# EAGLE design RTC-board (EAGLE 7.3.0)
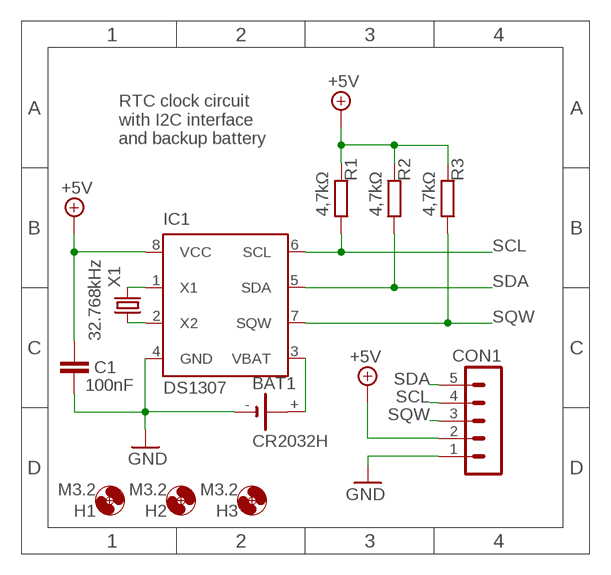
[diagram p0: schematic, sheet 1]

## Parts
BAT1  CR2032H  [CR2032H]
C1  100nF  C-EU050-025X075  [C050-025X075]
CON1  MA05-1  [MA05-1]
H1  M3.2  MOUNT-HOLE3.2  [3,2]
H2  M3.2  MOUNT-HOLE3.2  [3,2]
H3  M3.2  MOUNT-HOLE3.2  [3,2]
IC1  DS1307  [DIL08]
R1  4,7kΩ  R-EU_0207/7  [0207/7]
R2  4,7kΩ  R-EU_0207/7  [0207/7]
R3  4,7kΩ  R-EU_0207/7  [0207/7]
X1  32.768kHz  CRYSTALTC38H  [TC38H]

## Nets
+5V: C1.1 CON1.2 IC1.8(VCC) R1.2 R2.2 R3.2
GND: BAT1.- C1.2 CON1.1 IC1.4(GND)
N$20: IC1.1(X1) X1.2
N$21: IC1.2(X2) X1.1
N$22: BAT1.+ IC1.3(VBAT)
SCL: CON1.4 IC1.6(SCL) R1.1
SDA: CON1.5 IC1.5(SDA) R2.1
SQW: CON1.3 IC1.7(SQW) R3.1

## Notes on the sheet
- RTC clock circuit
  with I2C interface
  and backup battery

## Library data of the parts
BAT1 = ccr-lib:CR2032H: LI BATTERY HOLDER CR2032 horizontal
C1 = rcl:C-EU: CAPACITOR, European symbol
CON1 = con-lstb:MA05-1: PIN HEADER; OC_FARNELL: unknown; OC_NEWARK: unknown
H1-H3 = holes:MOUNT-HOLE: MOUNTING HOLE with drill center marker
IC1 = ds1307_pcf8583:DS1307: I2C-Bus CLOCK/CALENDAR
R1-R3 = rcl:R-EU_: RESISTOR, European symbol
X1 = adafruit:CRYSTAL: CRYSTAL; OC_FARNELL: unknown; OC_NEWARK: unknown

## Board
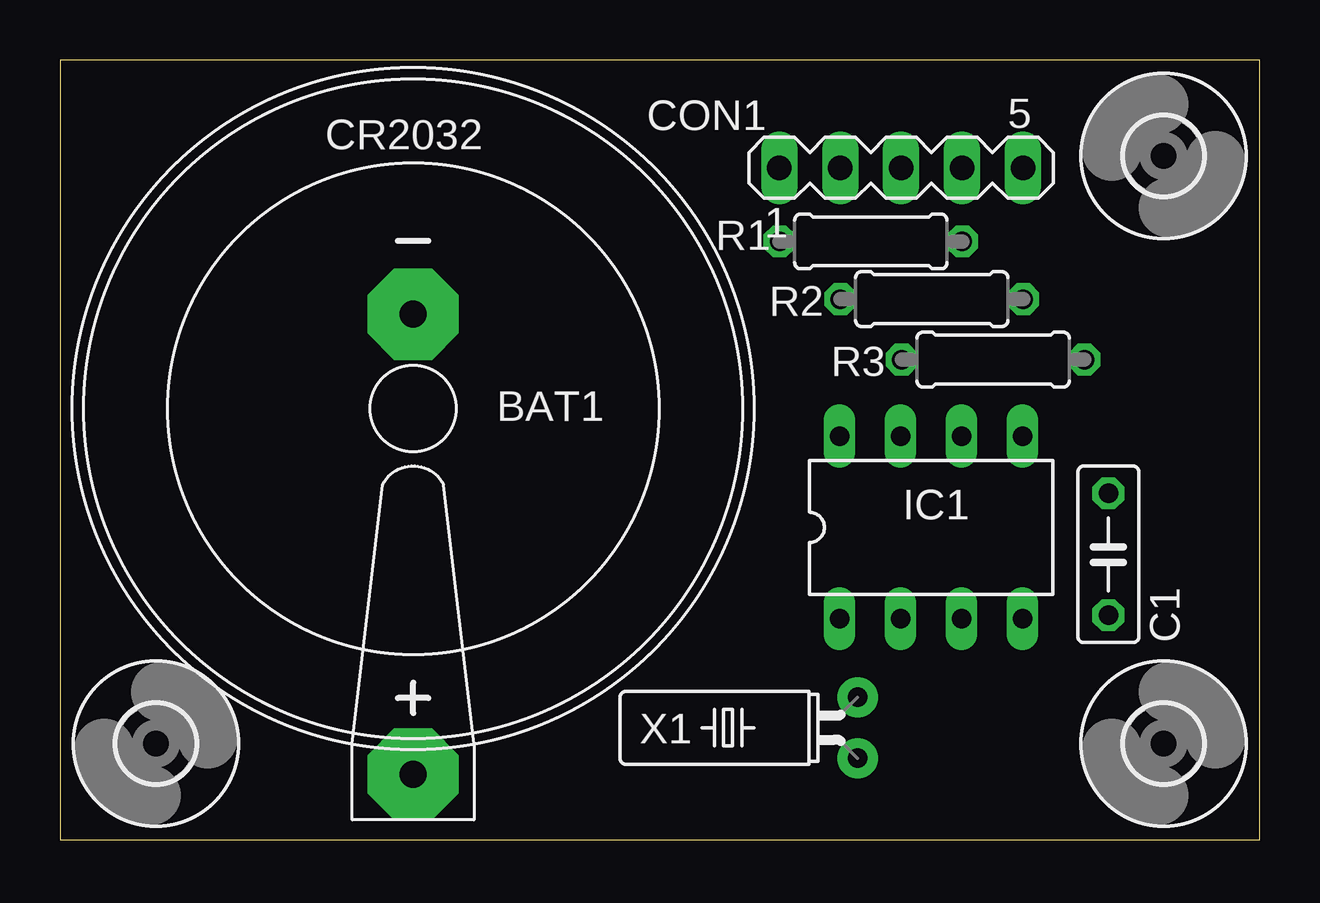
[diagram p1: board, top side]
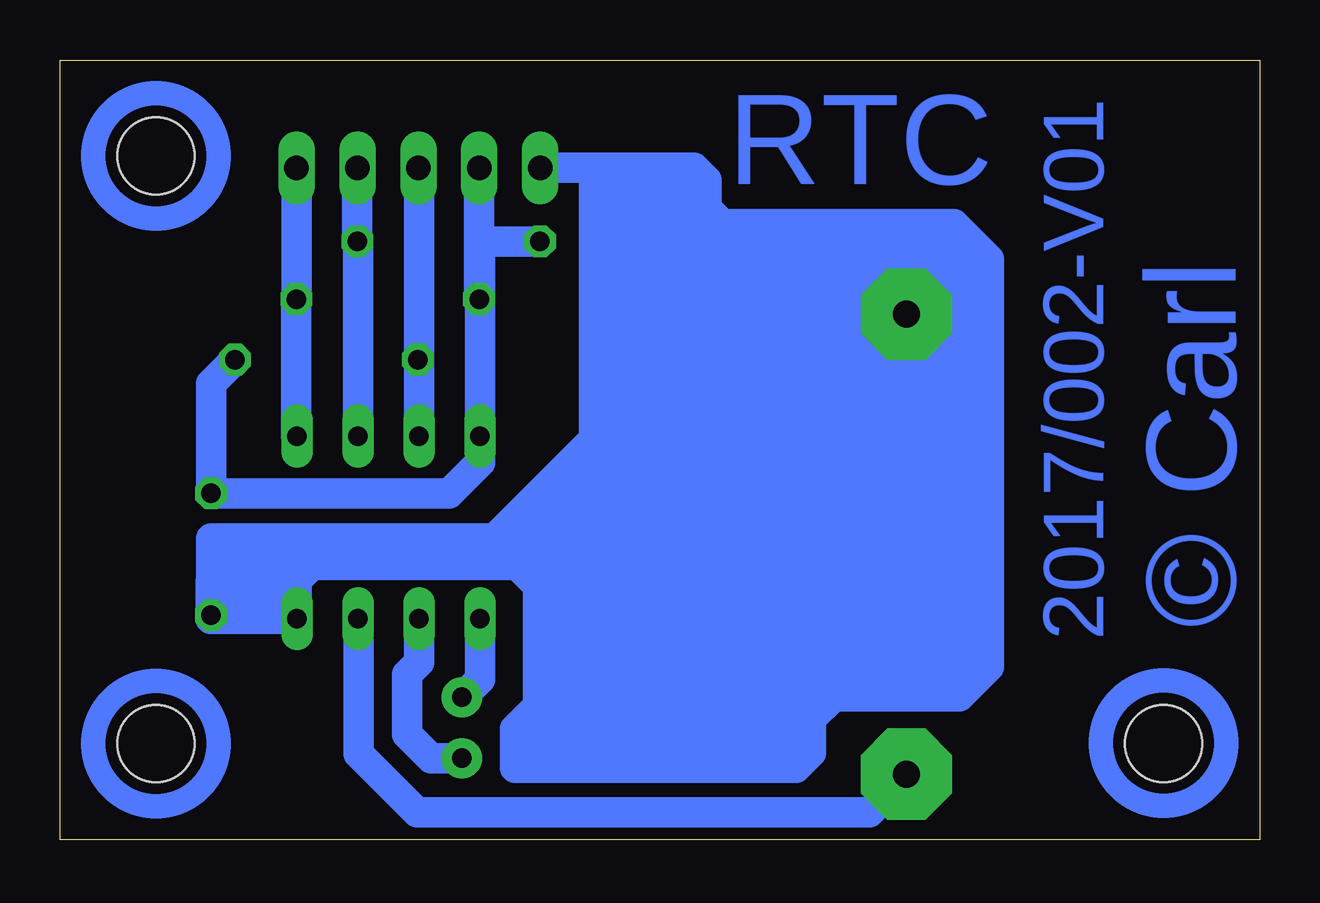
[diagram p2: board, bottom side, seen from below]

Size 50 x 32.5 mm. Coordinates in mm from the lower left corner, seen from the top.
Outline: 0,0 50,0 50,32.5 0,32.5 0,0
Copper layers (1*16): Top 0.035mm / dielectric 1.5mm / Bottom 0.035mm
Design rules "default": minimum track width 10mil, minimum drill 24mil, track to track 8mil, track to pad 8mil, pad to pad 8mil, via to via 8mil, smd to smd 8mil, copper to edge 40mil, drill to drill 8mil, minimum pad ring 10mil, minimum via ring 8mil, stop-mask expansion 4mil, vias tented up to drill 0mil, thermal gap 10mil

### Footprints (pad centres in the part's own frame; a part is rotated, then mirrored left to right if it is on the bottom)
CR2032H = drill 1.118 pad 3.81 octagon: + 0,15.24; - 0,-3.937
C050-025X075 = drill 0.813 octagon: 1 -2.54,0; 2 2.54,0
MA05-1 = drill 1.016 long: 1 -5.08,0; 2 -2.54,0; 3 0,0; 4 2.54,0; 5 5.08,0
3,2 = hole 3.2: 0,0
DIL08 = drill 0.813 long: 1 -3.81,-3.81; 2 -1.27,-3.81; 3 1.27,-3.81; 4 3.81,-3.81; 5 3.81,3.81; 6 1.27,3.81; 7 -1.27,3.81; 8 -3.81,3.81
0207/7 = drill 0.813 octagon: 1 -3.81,0; 2 3.81,0
TC38H = drill 0.813 pad 1.676: 1 -1.27,0; 2 1.27,0

### Placement (x,y rotation side)
BAT1  14.72,17.97 180 top
C1  43.7,11.89 270 top
CON1  35.06,28 0 top
H1  4,4 0 top
H2  46,4 180 top
H3  46,28.5 90 top
IC1  36.31,13.01 0 top
R1  33.8,24.94 180 top
R2  36.34,22.53 180 top
R3  38.9,20.01 0 top
X1  33.25,4.66 90 top

### Tracks (layer width: path | path; a pad name or v marks a point on that pad's centre or on a via)
+5V
  Bottom 1.27: CON1.2 R2.2 32.5,22.53 | 32.5,22.53 IC1.8 32.5,15.72 33.79,14.43 C1.1 43.7,19.01 R3.2 | 32.5,22.53 32.5,24.93 R1.2
GND
  Bottom 1.27: 43.65,9.35 43.65,12.51 32.49,12.51 32.49,12.55 31.89,12.55 27.74,16.7 27.74,21.83 27.74,21.9 | 43.65,9.35 C1.2 | 43.65,9.35 43.65,9.2 IC1.4 | CON1.1 27.74,28 27.74,21.9 | BAT1.- 27.74,21.9
N$1
  Bottom 1.27: 30,28 23.57,28 23.06,27.49 23.06,26.33 22.38,25.65 12.73,25.65 11.28,24.2 11.28,7.2 12.5,5.97 17.74,5.97 18.69,5.02 18.69,3.62 19.31,3 31.02,3 31.02,4.62 30.07,5.57 30.07,10.56 30.95,11.45 39.49,11.45 40.13,10.8 40.13,9.17 40.09,9.17 40.09,9.21 43.73,9.21 43.69,12.54 30.23,12.54
N$20
  Bottom 1.27: IC1.1 32.5,6.67 X1.2
N$21
  Bottom 1.27: X1.1 34.54,3.39 35.54,4.39 35.54,6.89 35.04,7.39 IC1.2
N$22
  Bottom 1.27: BAT1.+ 14.72,2.67 16.26,1.13 35.11,1.13 37.56,3.58 37.56,9.2 IC1.3
SCL
  Bottom 1.27: IC1.6 37.58,24.93 R1.1 CON1.4
SDA
  Bottom 1.27: CON1.5 R2.1 40.15,16.82 IC1.5
SQW
  Bottom 1.27: CON1.3 35.04,28 IC1.7 35.04,20.01 R3.1
(copper drawn outside any net)
  shapes: Bottom area x6, Bottom circle x3

### Text on the board
Bottom: RTC | © Carl | 2017/002-V01
tValues: +5V | SCL | SDA | GND | SQW